# EAGLE schematic Antler (EAGLE 9.6.2)
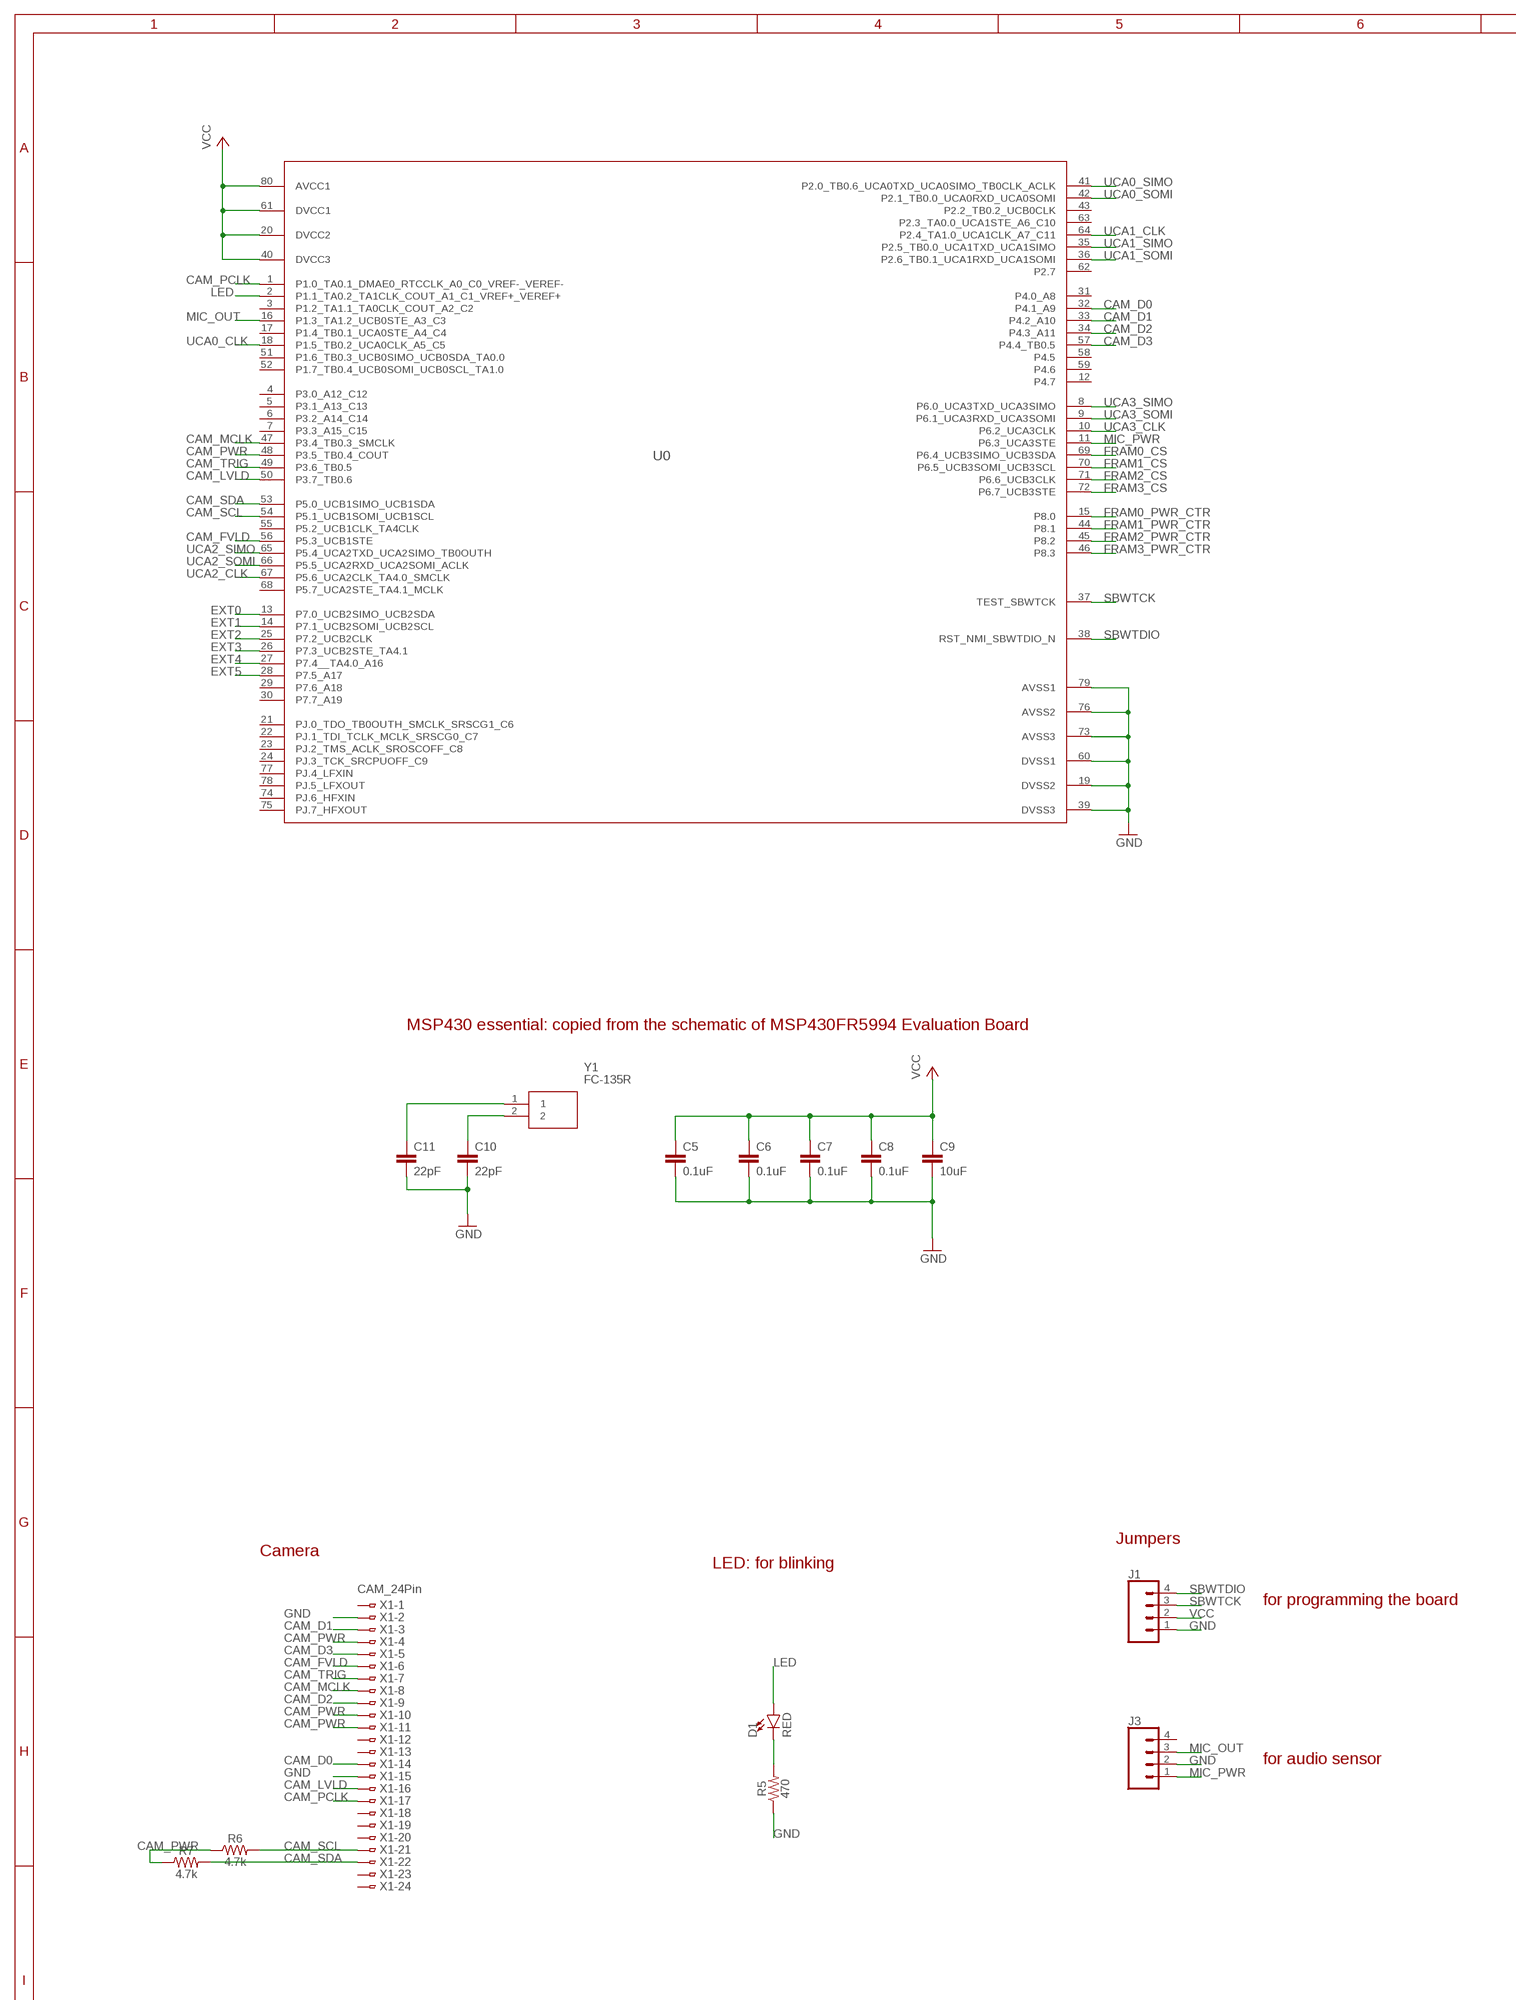
[diagram p0: schematic, sheet 1, part 1 of 2]
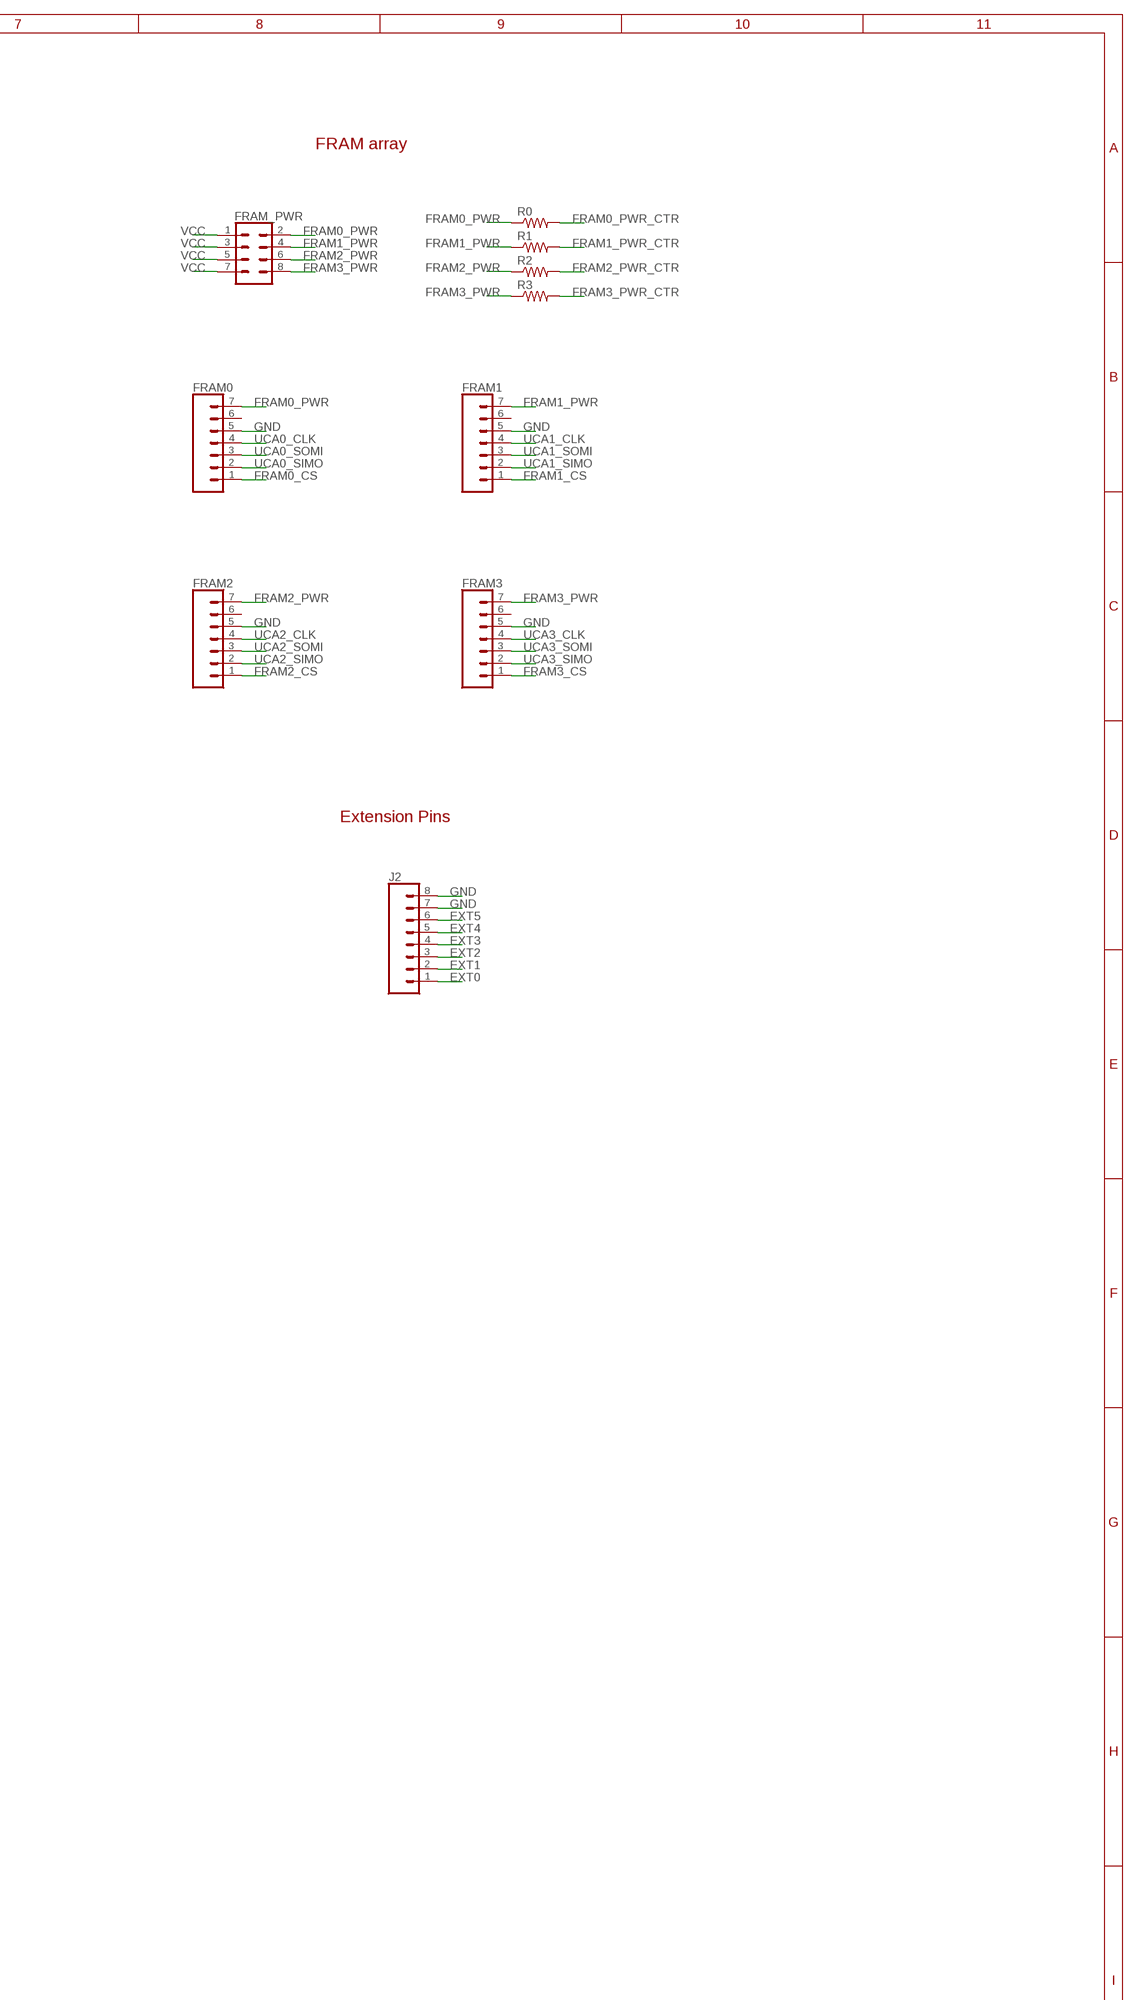
[diagram p1: schematic, sheet 1, part 2 of 2]

## Parts
C5  0.1uF  0.1UF-0603-25V-5%  [0603]
C6  0.1uF  0.1UF-0603-25V-5%  [0603]
C7  0.1uF  0.1UF-0603-25V-5%  [0603]
C8  0.1uF  0.1UF-0603-25V-5%  [0603]
C9  10uF  10UF-0603-6.3V-20%  [0603]
C10  22pF  22PF-0603-50V-5%  [0603]
C11  22pF  22PF-0603-50V-5%  [0603]
D1  RED  LED-RED0603  [LED-0603]
FRAM0  CONN_07LOCK  [1X07_LOCK]
FRAM1  CONN_07LOCK  [1X07_LOCK]
FRAM2  CONN_07LOCK  [1X07_LOCK]
FRAM3  CONN_07LOCK  [1X07_LOCK]
FRAM_PWR  CONN_04X2  [2X4]
J1  CONN_04LOCK  [1X04_LOCK]
J2  CONN_08LOCK  [1X08_LOCK]
J3  CONN_04LOCK  [1X04_LOCK]
R0  R-US_R0603  [R0603]
R1  R-US_R0603  [R0603]
R2  R-US_R0603  [R0603]
R3  R-US_R0603  [R0603]
R5  470  470OHM-0603-1/10W-1%  [0603]
R6  4.7k  4.7KOHM-0603-1/10W-1%  [0603]
R7  4.7k  4.7KOHM-0603-1/10W-1%  [0603]
U0  MSP430FR5994PN  MSP430FR5994IPN  [PN0080A_N]
X1  CAM_24Pin  FH12-24S-0.5SH  [FH12-24S-0.5SH]
Y1  FC-135R  [FC135327680KAAG0]

## Nets
CAM_D0: U0.32(P4.1_A9) X1.14
CAM_D1: U0.33(P4.2_A10) X1.3
CAM_D2: U0.34(P4.3_A11) X1.9
CAM_D3: U0.57(P4.4_TB0.5) X1.5
CAM_FVLD: U0.56(P5.3_UCB1STE) X1.6
CAM_LVLD: U0.50(P3.7_TB0.6) X1.16
CAM_MCLK: U0.47(P3.4_TB0.3_SMCLK) X1.8
CAM_PCLK: U0.1(P1.0_TA0.1_DMAE0_RTCCLK_A0_C0_VREF-_VEREF-) X1.17
CAM_PWR: R6.1 R7.1 U0.48(P3.5_TB0.4_COUT) X1.4 X1.10 X1.11
CAM_SCL: R6.2 U0.54(P5.1_UCB1SOMI_UCB1SCL) X1.21
CAM_SDA: R7.2 U0.53(P5.0_UCB1SIMO_UCB1SDA) X1.22
CAM_TRIG: U0.49(P3.6_TB0.5) X1.7
EXT0: J2.1 U0.13(P7.0_UCB2SIMO_UCB2SDA)
EXT1: J2.2 U0.14(P7.1_UCB2SOMI_UCB2SCL)
EXT2: J2.3 U0.25(P7.2_UCB2CLK)
EXT3: J2.4 U0.26(P7.3_UCB2STE_TA4.1)
EXT4: J2.5 U0.27(P7.4__TA4.0_A16)
EXT5: J2.6 U0.28(P7.5_A17)
FRAM0_CS: FRAM0.1 U0.69(P6.4_UCB3SIMO_UCB3SDA)
FRAM0_PWR: FRAM0.7 FRAM_PWR.2 R0.1
FRAM0_PWR_CTR: R0.2 U0.15(P8.0)
FRAM1_CS: FRAM1.1 U0.70(P6.5_UCB3SOMI_UCB3SCL)
FRAM1_PWR: FRAM1.7 FRAM_PWR.4 R1.1
FRAM1_PWR_CTR: R1.2 U0.44(P8.1)
FRAM2_CS: FRAM2.1 U0.71(P6.6_UCB3CLK)
FRAM2_PWR: FRAM2.7 FRAM_PWR.6 R2.1
FRAM2_PWR_CTR: R2.2 U0.45(P8.2)
FRAM3_CS: FRAM3.1 U0.72(P6.7_UCB3STE)
FRAM3_PWR: FRAM3.7 FRAM_PWR.8 R3.1
FRAM3_PWR_CTR: R3.2 U0.46(P8.3)
GND: C5.2 C6.2 C7.2 C8.2 C9.2 C10.2 C11.2 FRAM0.5 FRAM1.5 FRAM2.5 FRAM3.5 J1.1 J2.7 J2.8 J3.2 R5.1 U0.19(DVSS2) U0.39(DVSS3) U0.60(DVSS1) U0.73(AVSS3) U0.76(AVSS2) U0.79(AVSS1) X1.2 X1.15
LED: D1.A U0.2(P1.1_TA0.2_TA1CLK_COUT_A1_C1_VREF+_VEREF+)
MIC_OUT: J3.3 U0.16(P1.3_TA1.2_UCB0STE_A3_C3)
MIC_PWR: J3.1 U0.11(P6.3_UCA3STE)
N$1: C10.1 Y1.2
N$2: C11.1 Y1.1
N$11: D1.C R5.2
SBWTCK: J1.3 U0.37(TEST_SBWTCK)
SBWTDIO: J1.4 U0.38(RST_NMI_SBWTDIO_N)
UCA0_CLK: FRAM0.4 U0.18(P1.5_TB0.2_UCA0CLK_A5_C5)
UCA0_SIMO: FRAM0.2 U0.41(P2.0_TB0.6_UCA0TXD_UCA0SIMO_TB0CLK_ACLK)
UCA0_SOMI: FRAM0.3 U0.42(P2.1_TB0.0_UCA0RXD_UCA0SOMI)
UCA1_CLK: FRAM1.4 U0.64(P2.4_TA1.0_UCA1CLK_A7_C11)
UCA1_SIMO: FRAM1.2 U0.35(P2.5_TB0.0_UCA1TXD_UCA1SIMO)
UCA1_SOMI: FRAM1.3 U0.36(P2.6_TB0.1_UCA1RXD_UCA1SOMI)
UCA2_CLK: FRAM2.4 U0.67(P5.6_UCA2CLK_TA4.0_SMCLK)
UCA2_SIMO: FRAM2.2 U0.65(P5.4_UCA2TXD_UCA2SIMO_TB0OUTH)
UCA2_SOMI: FRAM2.3 U0.66(P5.5_UCA2RXD_UCA2SOMI_ACLK)
UCA3_CLK: FRAM3.4 U0.10(P6.2_UCA3CLK)
UCA3_SIMO: FRAM3.2 U0.8(P6.0_UCA3TXD_UCA3SIMO)
UCA3_SOMI: FRAM3.3 U0.9(P6.1_UCA3RXD_UCA3SOMI)
VCC: C5.1 C6.1 C7.1 C8.1 C9.1 FRAM_PWR.1 FRAM_PWR.3 FRAM_PWR.5 FRAM_PWR.7 J1.2 U0.20(DVCC2) U0.40(DVCC3) U0.61(DVCC1) U0.80(AVCC1)
Unconnected: FRAM0.6 FRAM1.6 FRAM2.6 FRAM3.6 J3.4 U0.3(P1.2_TA1.1_TA0CLK_COUT_A2_C2) U0.4(P3.0_A12_C12) U0.5(P3.1_A13_C13) U0.6(P3.2_A14_C14) U0.7(P3.3_A15_C15) U0.12(P4.7) U0.17(P1.4_TB0.1_UCA0STE_A4_C4) U0.21(PJ.0_TDO_TB0OUTH_SMCLK_SRSCG1_C6) U0.22(PJ.1_TDI_TCLK_MCLK_SRSCG0_C7) U0.23(PJ.2_TMS_ACLK_SROSCOFF_C8) U0.24(PJ.3_TCK_SRCPUOFF_C9) U0.29(P7.6_A18) U0.30(P7.7_A19) U0.31(P4.0_A8) U0.43(P2.2_TB0.2_UCB0CLK) U0.51(P1.6_TB0.3_UCB0SIMO_UCB0SDA_TA0.0) U0.52(P1.7_TB0.4_UCB0SOMI_UCB0SCL_TA1.0) U0.55(P5.2_UCB1CLK_TA4CLK) U0.58(P4.5) U0.59(P4.6) U0.62(P2.7) U0.63(P2.3_TA0.0_UCA1STE_A6_C10) U0.68(P5.7_UCA2STE_TA4.1_MCLK) U0.74(PJ.6_HFXIN) U0.75(PJ.7_HFXOUT) U0.77(PJ.4_LFXIN) U0.78(PJ.5_LFXOUT) X1.1 X1.12 X1.13 X1.18 X1.19 X1.20 X1.23 X1.24

## Notes on the sheet
- FRAM array
- Extension Pins
- MSP430 essential: copied from the schematic of MSP430FR5994 Evaluation Board
- Jumpers
- Camera
- LED: for blinking
- for programming the board
- for audio sensor

## Library data of the parts
C5-C8 = SparkFun-Capacitors:0.1UF: 0.1µF ceramic capacitors A capacitor is a passive two-terminal electrical component used to store electrical energy temporarily in an electric field.; PROD_ID: CAP-08604
C9 = SparkFun-Capacitors:10UF: 10.0µF ceramic capacitors A capacitor is a passive two-terminal electrical component used to store electrical energy temporarily in an electric field.; PROD_ID: CAP-11015
C10 C11 = SparkFun-Capacitors:22PF: 22pF ceramic capacitors A capacitor is a passive two-terminal electrical component used to store electrical energy temporarily in an electric field.; PROD_ID: CAP-07876
D1 = SparkFun-LED:LED-RED: Red SMD LED Used in manufacturing of most products at SparkFun Packages: 0603 - SMD 0603 package [Product Link] <http://docs.avagotech.com/docs/AV02-0551EN> 0603 SMART - SMD 0603 SMART package ( more efficient and expensive)[Product Link] <http://www.osram-os.com/Graphics/XPic2/00077099_0.pdf> 1206 - SMD1206 package [Product Link] <https://www.sparkfun.com/datasheets/DevTools/LilyPad/Q150OVS4.pdff> SparkFun Products: Pro Mini 328 -5V <https://www.sparkfun.com/products/821> RedBoard <https://www.sparkfun.com/products/12757> IOIO-OTG <https://www.sparkfun.com/products/13613>; PROD_ID: DIO-00819
FRAM0 FRAM1-FRAM3 = SparkFun-Connectors:CONN_07: Multi connection point. Often used as Generic Header-pin footprint for 0.1 inch spaced/style header connections On any of the 0.1 inch spaced packages, you can populate with these: Break Away Headers - Straight <https://www.sparkfun.com/products/116> (PRT-00116) Break Away Male Headers - Right Angle <https://www.sparkfun.com/products/553> (PRT-00553) Female Headers <https://www.sparkfun.com/products/115> (PRT-00115) Break Away Headers - Machine Pin <https://www.sparkfun.com/products/117> (PRT-00117) Break Away Female Headers - Swiss Machine Pin <https://www.sparkfun.com/products/743> (PRT-00743) For SCREWTERMINALS and SPRING TERMINALS visit here: Screw Terimnals on SparkFun.com <https://www.sparkfun.com/search/results?term=Screw+Terminals> (5mm/3.5mm/2.54mm spacing) This device is also useful as a general connection point to wire up your design to another part of your project. Our various solder wires solder well into these plated through hole pads. Hook-Up Wire - Assortment (Stranded, 22 AWG) <https://www.sparkfun.com/products/11375> (PRT-11375) Hook-Up Wire - Assortment (Solid Core, 22 AWG) <https://www.sparkfun.com/products/11367> (PRT-11367) View the entire wire category on our website here <https://www.sparkfun.com/categories/141> Special notes: Molex polarized connector foot print use with SKU : PRT-08231 with associated crimp pins and housings. 1MM SMD Version SKU: PRT-10208 NOTES ON THE VARIANTS LOCK and LOCK_LONGPADS... This footprint was designed to help hold the alignment of a through-hole component (i.e. 6-pin header) while soldering it into place. You may notice that each hole has been shifted either up or down by 0.005 of an inch from it's more standard position (which is a perfectly straight line). This slight alteration caused the pins (the squares in the middle) to touch the edges of the holes. Because they are alternating, it causes a "brace" to hold the component in place. 0.005 has proven to be the perfect amount of "off-center" position when using our standard breakaway headers. Although looks a little odd when you look at the bare footprint, once you have a header in there, the alteration is very hard to notice. Also,if you push a header all the way into place, it is covered up entirely on the bottom side.
FRAM_PWR = SparkFun-Connectors:CONN_04X2: Multi connection point. Often used as Generic Header-pin footprint for 0.1 inch spaced/style header connections On any of the 0.1 inch spaced packages, you can populate with these: Break Away Headers - Straight <https://www.sparkfun.com/products/116> (PRT-00116) Break Away Male Headers - Right Angle <https://www.sparkfun.com/products/553> (PRT-00553) Female Headers <https://www.sparkfun.com/products/115> (PRT-00115) Break Away Headers - Machine Pin <https://www.sparkfun.com/products/117> (PRT-00117) Break Away Female Headers - Swiss Machine Pin <https://www.sparkfun.com/products/743> (PRT-00743)
J1 J3 = SparkFun-Connectors:CONN_04: Multi connection point. Often used as Generic Header-pin footprint for 0.1 inch spaced/style header connections On any of the 0.1 inch spaced packages, you can populate with these: Break Away Headers - Straight <https://www.sparkfun.com/products/116> (PRT-00116) Break Away Male Headers - Right Angle <https://www.sparkfun.com/products/553> (PRT-00553) Female Headers <https://www.sparkfun.com/products/115> (PRT-00115) Break Away Headers - Machine Pin <https://www.sparkfun.com/products/117> (PRT-00117) Break Away Female Headers - Swiss Machine Pin <https://www.sparkfun.com/products/743> (PRT-00743) For SCREWTERMINALS and SPRING TERMINALS visit here: Screw Terimnals on SparkFun.com <https://www.sparkfun.com/search/results?term=Screw+Terminals> (5mm/3.5mm/2.54mm spacing) This device is also useful as a general connection point to wire up your design to another part of your project. Our various solder wires solder well into these plated through hole pads. Hook-Up Wire - Assortment (Stranded, 22 AWG) <https://www.sparkfun.com/products/11375> (PRT-11375) Hook-Up Wire - Assortment (Solid Core, 22 AWG) <https://www.sparkfun.com/products/11367> (PRT-11367) View the entire wire category on our website here <https://www.sparkfun.com/categories/141> Special notes: Molex polarized connector foot print use with SKU : PRT-08231 with associated crimp pins and housings. 1MM SMD Version SKU: PRT-10208; PROD_ID: CONN-09696
J2 = SparkFun-Connectors:CONN_08: Multi connection point. Often used as Generic Header-pin footprint for 0.1 inch spaced/style header connections On any of the 0.1 inch spaced packages, you can populate with these: Break Away Headers - Straight <https://www.sparkfun.com/products/116> (PRT-00116) Break Away Male Headers - Right Angle <https://www.sparkfun.com/products/553> (PRT-00553) Female Headers <https://www.sparkfun.com/products/115> (PRT-00115) Break Away Headers - Machine Pin <https://www.sparkfun.com/products/117> (PRT-00117) Break Away Female Headers - Swiss Machine Pin <https://www.sparkfun.com/products/743> (PRT-00743) Arduino Stackable Header - 8 Pin <https://www.sparkfun.com/products/9279> (PRT-09279) For SCREWTERMINALS and SPRING TERMINALS visit here: Screw Terimnals on SparkFun.com <https://www.sparkfun.com/search/results?term=Screw+Terminals> (5mm/3.5mm/2.54mm spacing) This device is also useful as a general connection point to wire up your design to another part of your project. Our various solder wires solder well into these plated through hole pads. Hook-Up Wire - Assortment (Stranded, 22 AWG) <https://www.sparkfun.com/products/11375> (PRT-11375) Hook-Up Wire - Assortment (Solid Core, 22 AWG) <https://www.sparkfun.com/products/11367> (PRT-11367) View the entire wire category on our website here <https://www.sparkfun.com/categories/141> Special notes: Molex polarized connector foot print use with SKU : PRT-08231 with associated crimp pins and housings. 1MM SMD Version SKU: PRT-10208 NOTES ON THE VARIANTS LOCK and LOCK_LONGPADS... This footprint was designed to help hold the alignment of a through-hole component (i.e. 6-pin header) while soldering it into place. You may notice that each hole has been shifted either up or down by 0.005 of an inch from it's more standard position (which is a perfectly straight line). This slight alteration caused the pins (the squares in the middle) to touch the edges of the holes. Because they are alternating, it causes a "brace" to hold the component in place. 0.005 has proven to be the perfect amount of "off-center" position when using our standard breakaway headers. Although looks a little odd when you look at the bare footprint, once you have a header in there, the alteration is very hard to notice. Also,if you push a header all the way into place, it is covered up entirely on the bottom side.
R0 R1-R3 = rcl:R-US_: RESISTOR, American symbol; SPICEPREFIX: R
R5 = SparkFun-Resistors:470OHM: 470Ω resistor A resistor is a passive two-terminal electrical component that implements electrical resistance as a circuit element. Resistors act to reduce current flow, and, at the same time, act to lower voltage levels within circuits. - Wikipedia; PROD_ID: RES-07869
R6 R7 = SparkFun-Resistors:4.7KOHM: 4.7kΩ resistor A resistor is a passive two-terminal electrical component that implements electrical resistance as a circuit element. Resistors act to reduce current flow, and, at the same time, act to lower voltage levels within circuits. - Wikipedia; PROD_ID: RES-07857
U0 = MSP430FR5994_MCU_80pin:MSP430FR5994IPN; MANUFACTURER: Texas Instruments; PARTNUMBER: MSP430FR5994IPNR; REFDES: RefDes; TYPE: TYPE; VALUE: Value
X1 = con-hirose:FH12-24S-0.5S: 0.5mm Pitch Connectors For FPC/FFC Source: Data sheet <http://www.hirose.co.jp/cataloge_hp/e58605370.pdf>; MPN: FH12-24S-0.5SH(55); OC_FARNELL: 1324552; OC_NEWARK: 34M6170
Y1 = FC-135R:FC-135R: https://www.mouser.com/ds/2/137/1699449-465441.pdf Source: Datasheet <https://www.mouser.com/ds/2/137/1699449-465441.pdf>; ARROW_PART_NUMBER: FC-135R; DESCRIPTION: https://www.mouser.com/ds/2/137/1699449-465441.pdf; HEIGHT: mm; MANUFACTURER_NAME: SEIKO INSTRUMENTS; MANUFACTURER_PART_NUMBER: FC-135R